# Altium schematic sheet Andromeda-UIXO.SchDoc
size A2
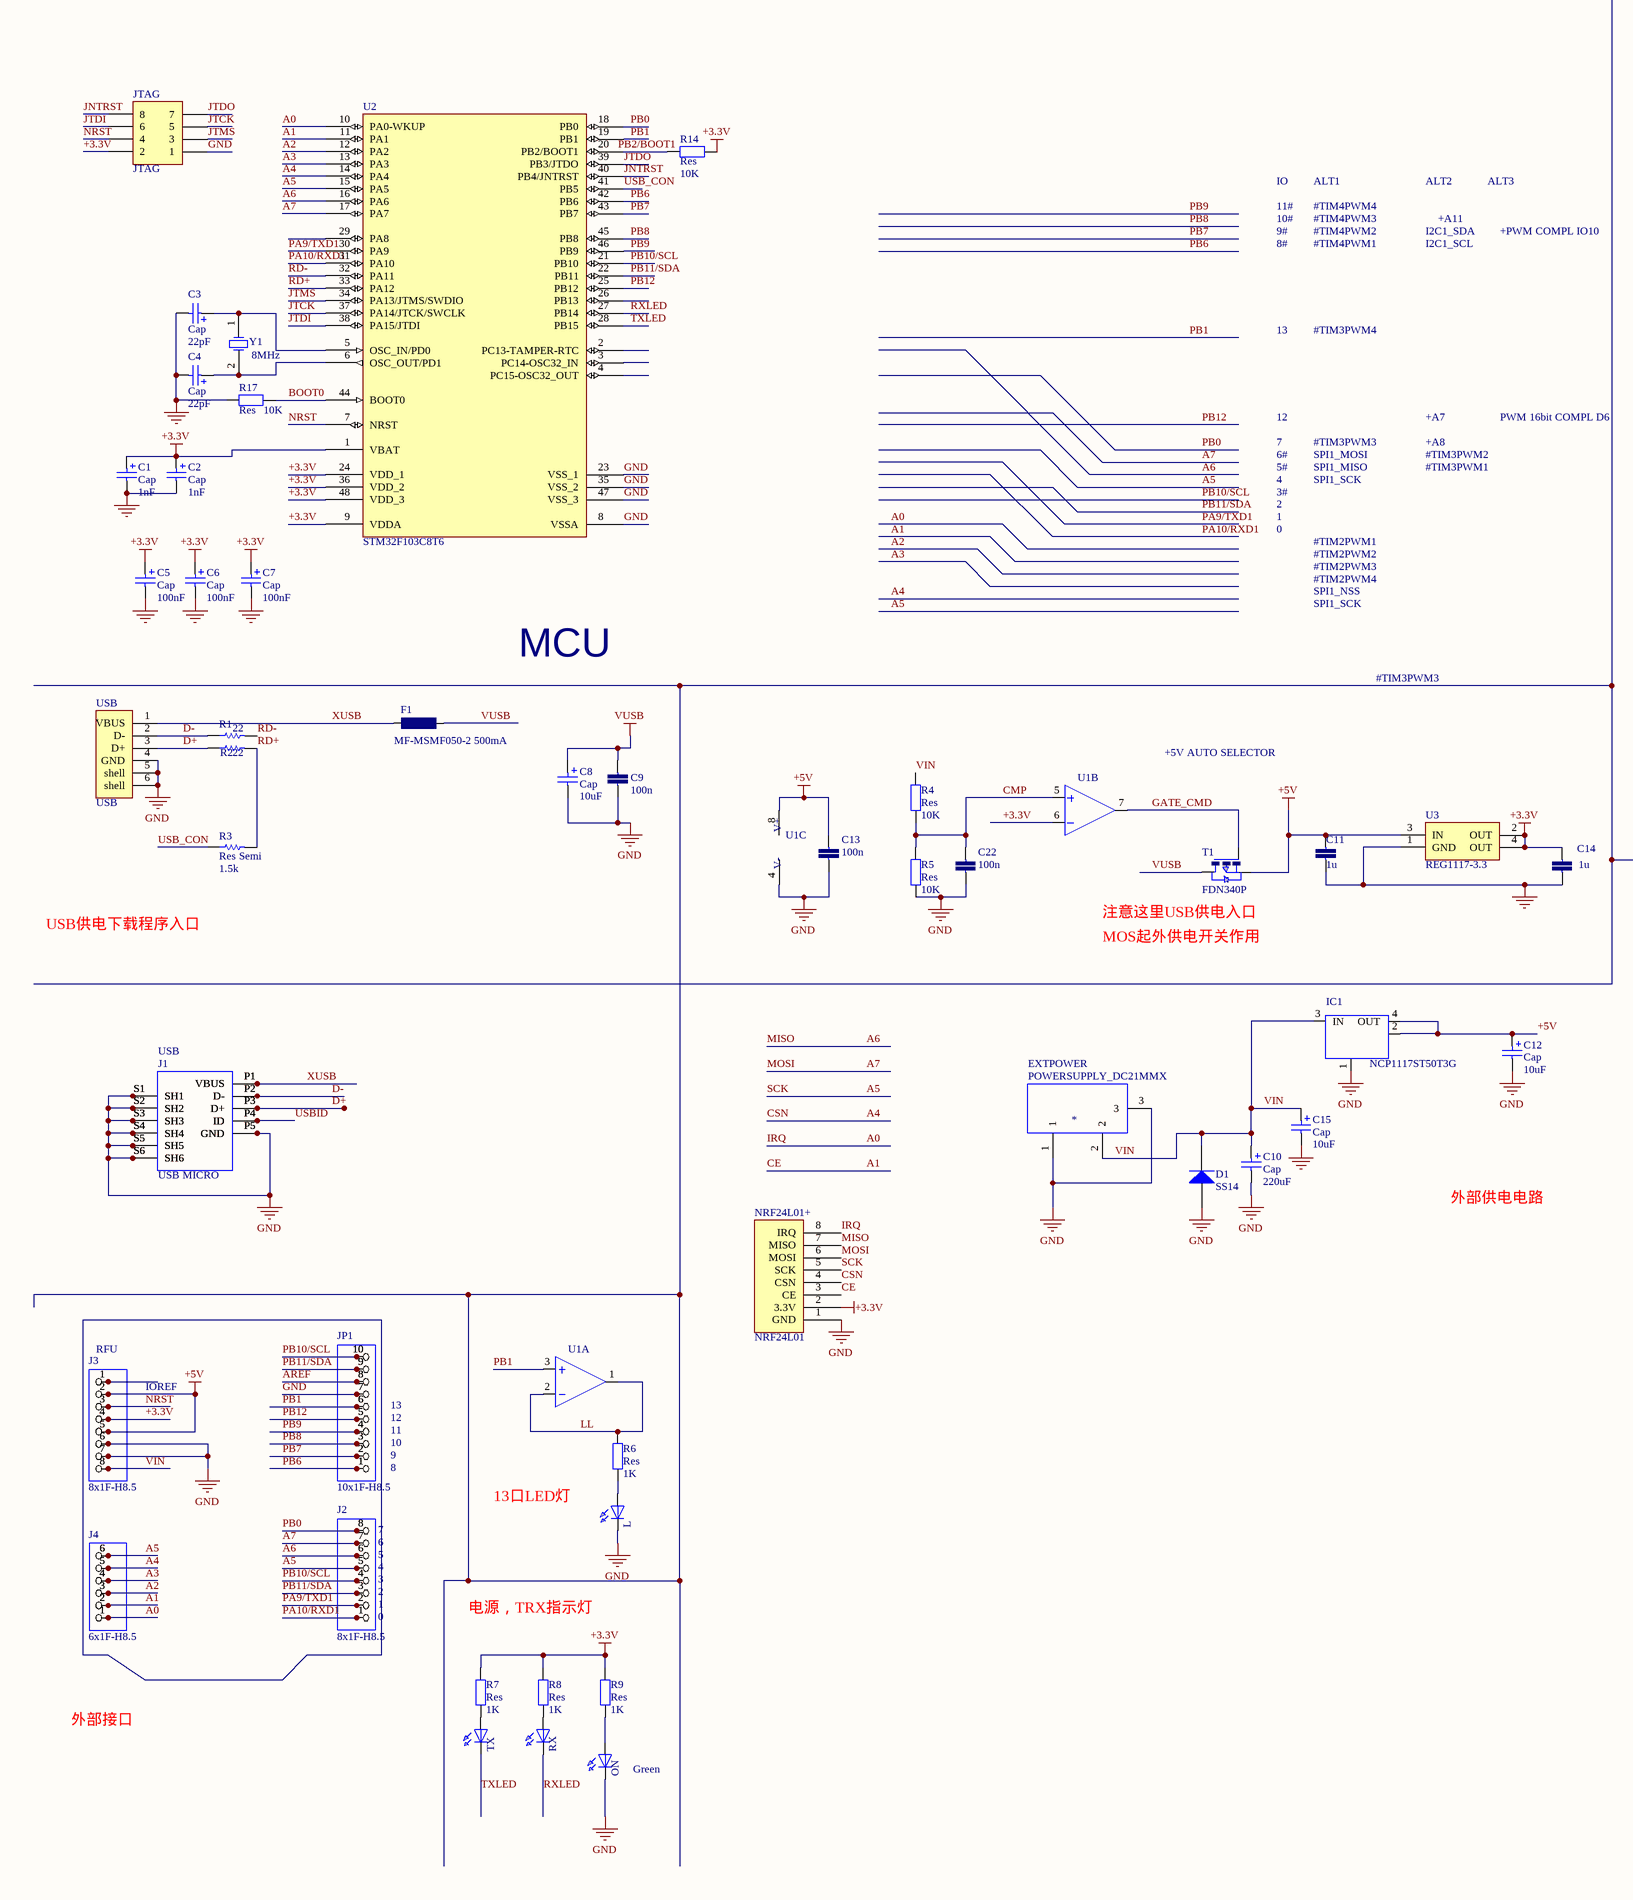
[diagram p0: Andromeda-UIXO.SchDoc, left]

## Parts
C1  Cap  value 1nF  [RES0805(2012M)]
C2  Cap  value 1nF  [RES0805(2012M)]
C3  Cap  value 22pF  [RES0805(2012M)]
C4  Cap  value 22pF  [RES0805(2012M)]
C5  Cap  value 100nF  [RES0805(2012M)]
C6  Cap  value 100nF  [RES0805(2012M)]
C7  Cap  value 100nF  [RES0805(2012M)]
C8  Cap  value 10uF  [RES0805(2012M)]
C9  100n  [RES0805(2012M)]
C10  Cap  value 220uF  [CAP_SMD]
C11  1u  [RES0805(2012M)]
C12  Cap  value 10uF  [RES0805(2012M)]
C13  100n  [RES0805(2012M)]
C14  1u  [RES0805(2012M)]
C15  Cap  value 10uF  [RES0805(2012M)]
C22  100n  [RES0805(2012M)]
D1  SS14  [DIODE_SMA]
EXTPOWER  *  [POWERSUPPLY_DC-21MM]
F1  MF-MSMF050-2 500mA  [L1812]
IC1  NCP1117ST50T3G  [SOT223]
J1  USB MICRO  [CON2_USB_MICRO_B_AT]
J2  8x1F-H8.5  [1X08]
J3  8x1F-H8.5  [1X08]
J4  6x1F-H8.5  [1X06]
JP1  10x1F-H8.5  [1X10]
JTAG  JTAG  [HDR2X4]
L  Yellow  [CHIPLED_0805]  (value not drawn)
NRF24L01+  NRF24L01  [NRF24L01]
ON  Green  [CHIPLED_0805]
R1  value 22  [RES0805(2012M)]  (hidden comment: Res Semi)
R2  value 22  [RES0805(2012M)]  (hidden comment: Res Semi)
R3  Res Semi  value 1.5k  [RES0805(2012M)]
R4  Res  value 10K  [RES0805(2012M)]
R5  Res  value 10K  [RES0805(2012M)]
R6  Res  value 1K  [RES0805(2012M)]
R7  Res  value 1K  [RES0805(2012M)]
R8  Res  value 1K  [RES0805(2012M)]
R9  Res  value 1K  [RES0805(2012M)]
R14  Res  value 10K  [RES0805(2012M)]
R17  Res  value 10K  [RES0805(2012M)]
RX  Yellow  [CHIPLED_0805]  (value not drawn)
T1  FDN340P  [SOT-23]
TX  Yellow  [CHIPLED_0805]  (value not drawn)
U1  LMV358IDGKR  [SO-8 LM358]  (value not drawn)  (parts A,B,C of 3)
U2  STM32F103C8T6  [LQFP48_M]
U3  REG1117-3.3  [SOT223]
USB  USB  [USB/SM2.5-4H4A]
Y1  8MHz  [XTAL_0.4]

## Nets
+3.3V: C1.1 C2.1 C5.1 C6.1 C7.1 C14.2 J3.4 JTAG.2 NRF24L01+.2(3.3V) R7.1 R8.1 R9.1 R14.1 U1.6(-IN) U2.1(VBAT) U2.9(VDDA) U2.24(VDD_1) U2.36(VDD_2) U2.48(VDD_3) U3.2(OUT) U3.4(OUT)
+5V: C11.2 C12.1 C13.1 IC1.2(OUT@1) IC1.4(OUT) J3.2 J3.5 T1.2(S) U1.8(V+) U3.3(IN)
GND: C1.2 C2.2 C3.2 C4.2 C5.2 C6.2 C7.2 C8.2 C9.1 C10.2 C11.1 C12.2 C13.2 C14.1 C15.2 C22.1 D1.1(A) EXTPOWER.1 EXTPOWER.3 IC1.1(GND/ADJ) J1.P5(GND) J1.S1(SH1) J1.S2(SH2) J1.S3(SH3) J1.S4(SH4) J1.S5(SH5) J1.S6(SH6) J3.6 J3.7 JP1.7 JTAG.1 L.C NRF24L01+.1(GND) ON.C R5.2 R17.2 U1.4(V-) U2.8(VSSA) U2.23(VSS_1) U2.35(VSS_2) U2.47(VSS_3) U3.1(GND) USB.4(GND) USB.5(shell) USB.6(shell)
VUSB: C8.1 C9.2 F1.1 T1.1(D)
A0: J4.1 NRF24L01+.8(IRQ) U2.10(PA0-WKUP)  [also labelled IRQ]
A1: J4.2 NRF24L01+.3(CE) U2.11(PA1)  [also labelled CE]
A2: J4.3 U2.12(PA2)
A3: J4.4 U2.13(PA3)
A4: J4.5 NRF24L01+.4(CSN) U2.14(PA4)  [also labelled CSN]
A5: J2.5 J4.6 NRF24L01+.5(SCK) U2.15(PA5)  [also labelled SCK]
A6: J2.6 NRF24L01+.7(MISO) U2.16(PA6)  [also labelled MISO]
A7: J2.7 NRF24L01+.6(MOSI) U2.17(PA7)  [also labelled MOSI]
AREF: JP1.8
BOOT0: R17.1 U2.44(BOOT0)
CMP: C22.2 R4.2 R5.1 U1.5(+IN)
D+: J1.P3(D+) R2.1 USB.3(D+)
D-: J1.P2(D-) R1.1 USB.2(D-)
GATE_CMD: T1.3(G) U1.7(OUT)
JNTRST: JTAG.8 U2.40(PB4/JNTRST)
JTCK: JTAG.5 U2.37(PA14/JTCK/SWCLK)
JTDI: JTAG.6 U2.38(PA15/JTDI)
JTDO: JTAG.7 U2.39(PB3/JTDO)
JTMS: JTAG.3 U2.34(PA13/JTMS/SWDIO)
LL: R6.1 U1.1(OUT) U1.2(-IN)
NRST: J3.3 JTAG.4 U2.7(NRST)
PA9/TXD1: J2.2 U2.30(PA9)
PA10/RXD1: J2.1 U2.31(PA10)
PB0: J2.8 U2.18(PB0)
PB1: JP1.6 U1.3(+IN) U2.19(PB1)
PB6: JP1.1 U2.42(PB6)
PB7: JP1.2 U2.43(PB7)
PB8: JP1.3 U2.45(PB8)
PB9: JP1.4 U2.46(PB9)
PB10/SCL: J2.4 JP1.10 U2.21(PB10)
PB11/SDA: J2.3 JP1.9 U2.22(PB11)
PB12: JP1.5 U2.25(PB12)
RD+: R2.2 R3.2 U2.33(PA12)
RD-: R1.2 U2.32(PA11)
RXLED: RX.C U2.27(PB14)
TXLED: TX.C U2.28(PB15)
USB_CON: R3.1 U2.41(PB5)
USBID: J1.P4(ID)
VIN: C10.1 C15.1 D1.2(K) EXTPOWER.2 IC1.3(IN) J3.8 R4.1
XUSB: F1.2 J1.P1(VBUS) USB.1(VBUS)
NetC3_1: C3.1 U2.5(OSC_IN/PD0) Y1.1(OSC1)
NetC4_1: C4.1 U2.6(OSC_OUT/PD1) Y1.2(OSC2)
NetL_A: L.A R6.2
NetON_A: ON.A R9.2
NetR7_2: R7.2 TX.A
NetR8_2: R8.2 RX.A
NetR14_2: R14.2 U2.20(PB2/BOOT1)

Not connected (* = marked no-connect by the designer): J3 1; U2 2(PC13-TAMPER-RTC) 3(PC14-OSC32_IN) 4(PC15-OSC32_OUT) 26(PB13) 29(PA8)

## Notes on the sheet
- IO
- ALT1
- ALT2
- ALT3
- 10#
- 9#
- 11#
- 8#
- #TIM4PWM4
- #TIM4PWM3
- #TIM4PWM1
- #TIM4PWM2
- I2C1_SCL
- I2C1_SDA
- +A11
- +PWM COMPL IO10
- 13
- #TIM3PWM4
- 12
- +A7
- PWM 16bit COMPL D6
- 3#
- 4
- 5#
- 6#
- 7
- SPI1_MISO
- SPI1_SCK
- SPI1_MOSI
- #TIM3PWM3
- +A8
- #TIM3PWM1
- #TIM3PWM2
- 0
- 1
- 2
- #TIM2PWM1
- #TIM2PWM2
- #TIM2PWM3
- #TIM2PWM4
- SPI1_NSS
- MCU
- +5V AUTO SELECTOR
- USB供电下载程序入口
- (near T1) 注意这里USB供电入口
- MOS起外供电开关作用
- (near J1) USB
- 外部供电电路
- (near J3) RFU
- IOREF
- (near JP1) 11
- (near JP1) 12
- (near JP1) 13
- (near JP1) 8
- (near JP1) 9
- (near JP1) 10
- (near J2) 5
- (near J2) 6
- (near J2) 7
- 13口LED灯
- (near J2) 1
- (near J2) 2
- (near J2) 3
- (near J2) 4
- 电源，TRX指示灯
- (near J2) 0
- 外部接口
- Labels drawn without touching a wire or pin: PB2/BOOT1

## Library data of the parts
C9 C13 C22 = C-EUC0603: value: 100nF
C11 C14 = C-EUC0603: value: 1uF
D1 = DIODE_SWITCH
EXTPOWER = POWERSUPPLY_DC21MMX
F1 = L-EUL1812
IC1 = MC33269ST-3.3T3
J1 = MYCON2_USB-MINI-B
J2 J3 = PINHD-1X8
J4 = PINHD-1X6
JP1 = PINHD-1X10
JTAG = Header 4X2: Header, 4-Pin, Dual row; LatestRevisionDate: 17-Jul-2002; LatestRevisionNote: Re-released for DXP Platform.; Publisher: Altium Limited
L ON RX TX = LEDCHIPLED_0805
NRF24L01+ = NRF24L01: NRF24L01+
R1-R3 = Res Semi: Semiconductor Resistor; Published: 8-Jun-2000; LatestRevisionDate: 17-Jul-2002; LatestRevisionNote: Re-released for DXP Platform.; PackageReference: RES0805(2012M); Publisher: Altium Limited
R4-R9 R14 R17 = Res: Resistor
T1 = PMOSSOT23
U1 = LMV358MMX
U2 = STM32F103C8T6: STM32 ARM-based 32-bit MCU with 64 Kbytes Flash, 48-pin LQFP, Industrial Temperature; Published: 30-May-2008; DatasheetVersion: rev6, Mar-2008; PackageVersion: Mar-2008; PackageReference: LQFP48; Publisher: Altium Limited; PackageDescription: 48-Pin Low-Profile Quad Flat Pack, 7 x 7 mm Body, 0.5 mm Pitch (LQFP48); ComponentLink1Description: Manufacturer Link; ComponentLink1URL: www.st.com/stm32; ComponentLink2Description: Datasheet; ComponentLink2URL: http://www.st.com/stonline/products/literature/ds/13587.pdf
U3 = REG1117-3.3: 800mA and 1A Low Dropout Positive Regulator 2.85V, 3.3V, 5V, and Adjustable; Published: 8-Jun-2000; LatestRevisionDate: 17-Jul-2002; LatestRevisionNote: Re-released for DXP Platform.; DatasheetVersion: Sep-1997; PackageVersion: revC; PackageReference: ZZ311; Publisher: Altium Limited; PackageDescription: SOT-223/SC-73; 4 Leads; Body 6.7 x 7.3 mm, inc. leads (LxW max); ComponentLink1Description: Manufacturer Link; ComponentLink1URL: http://www.ti.com/; ComponentLink2Description: Datasheet; ComponentLink2URL: http://www-s.ti.com/sc/ds/REG1117.pdf
Y1 = XTAL: Crystal Oscillator; Published: 8-Jun-2000; LatestRevisionDate: 17-Jul-2002; LatestRevisionNote: Re-released for DXP Platform.; PackageReference: R38; Publisher: Altium Limited